# Altium project HMI Adapter.PrjPcb
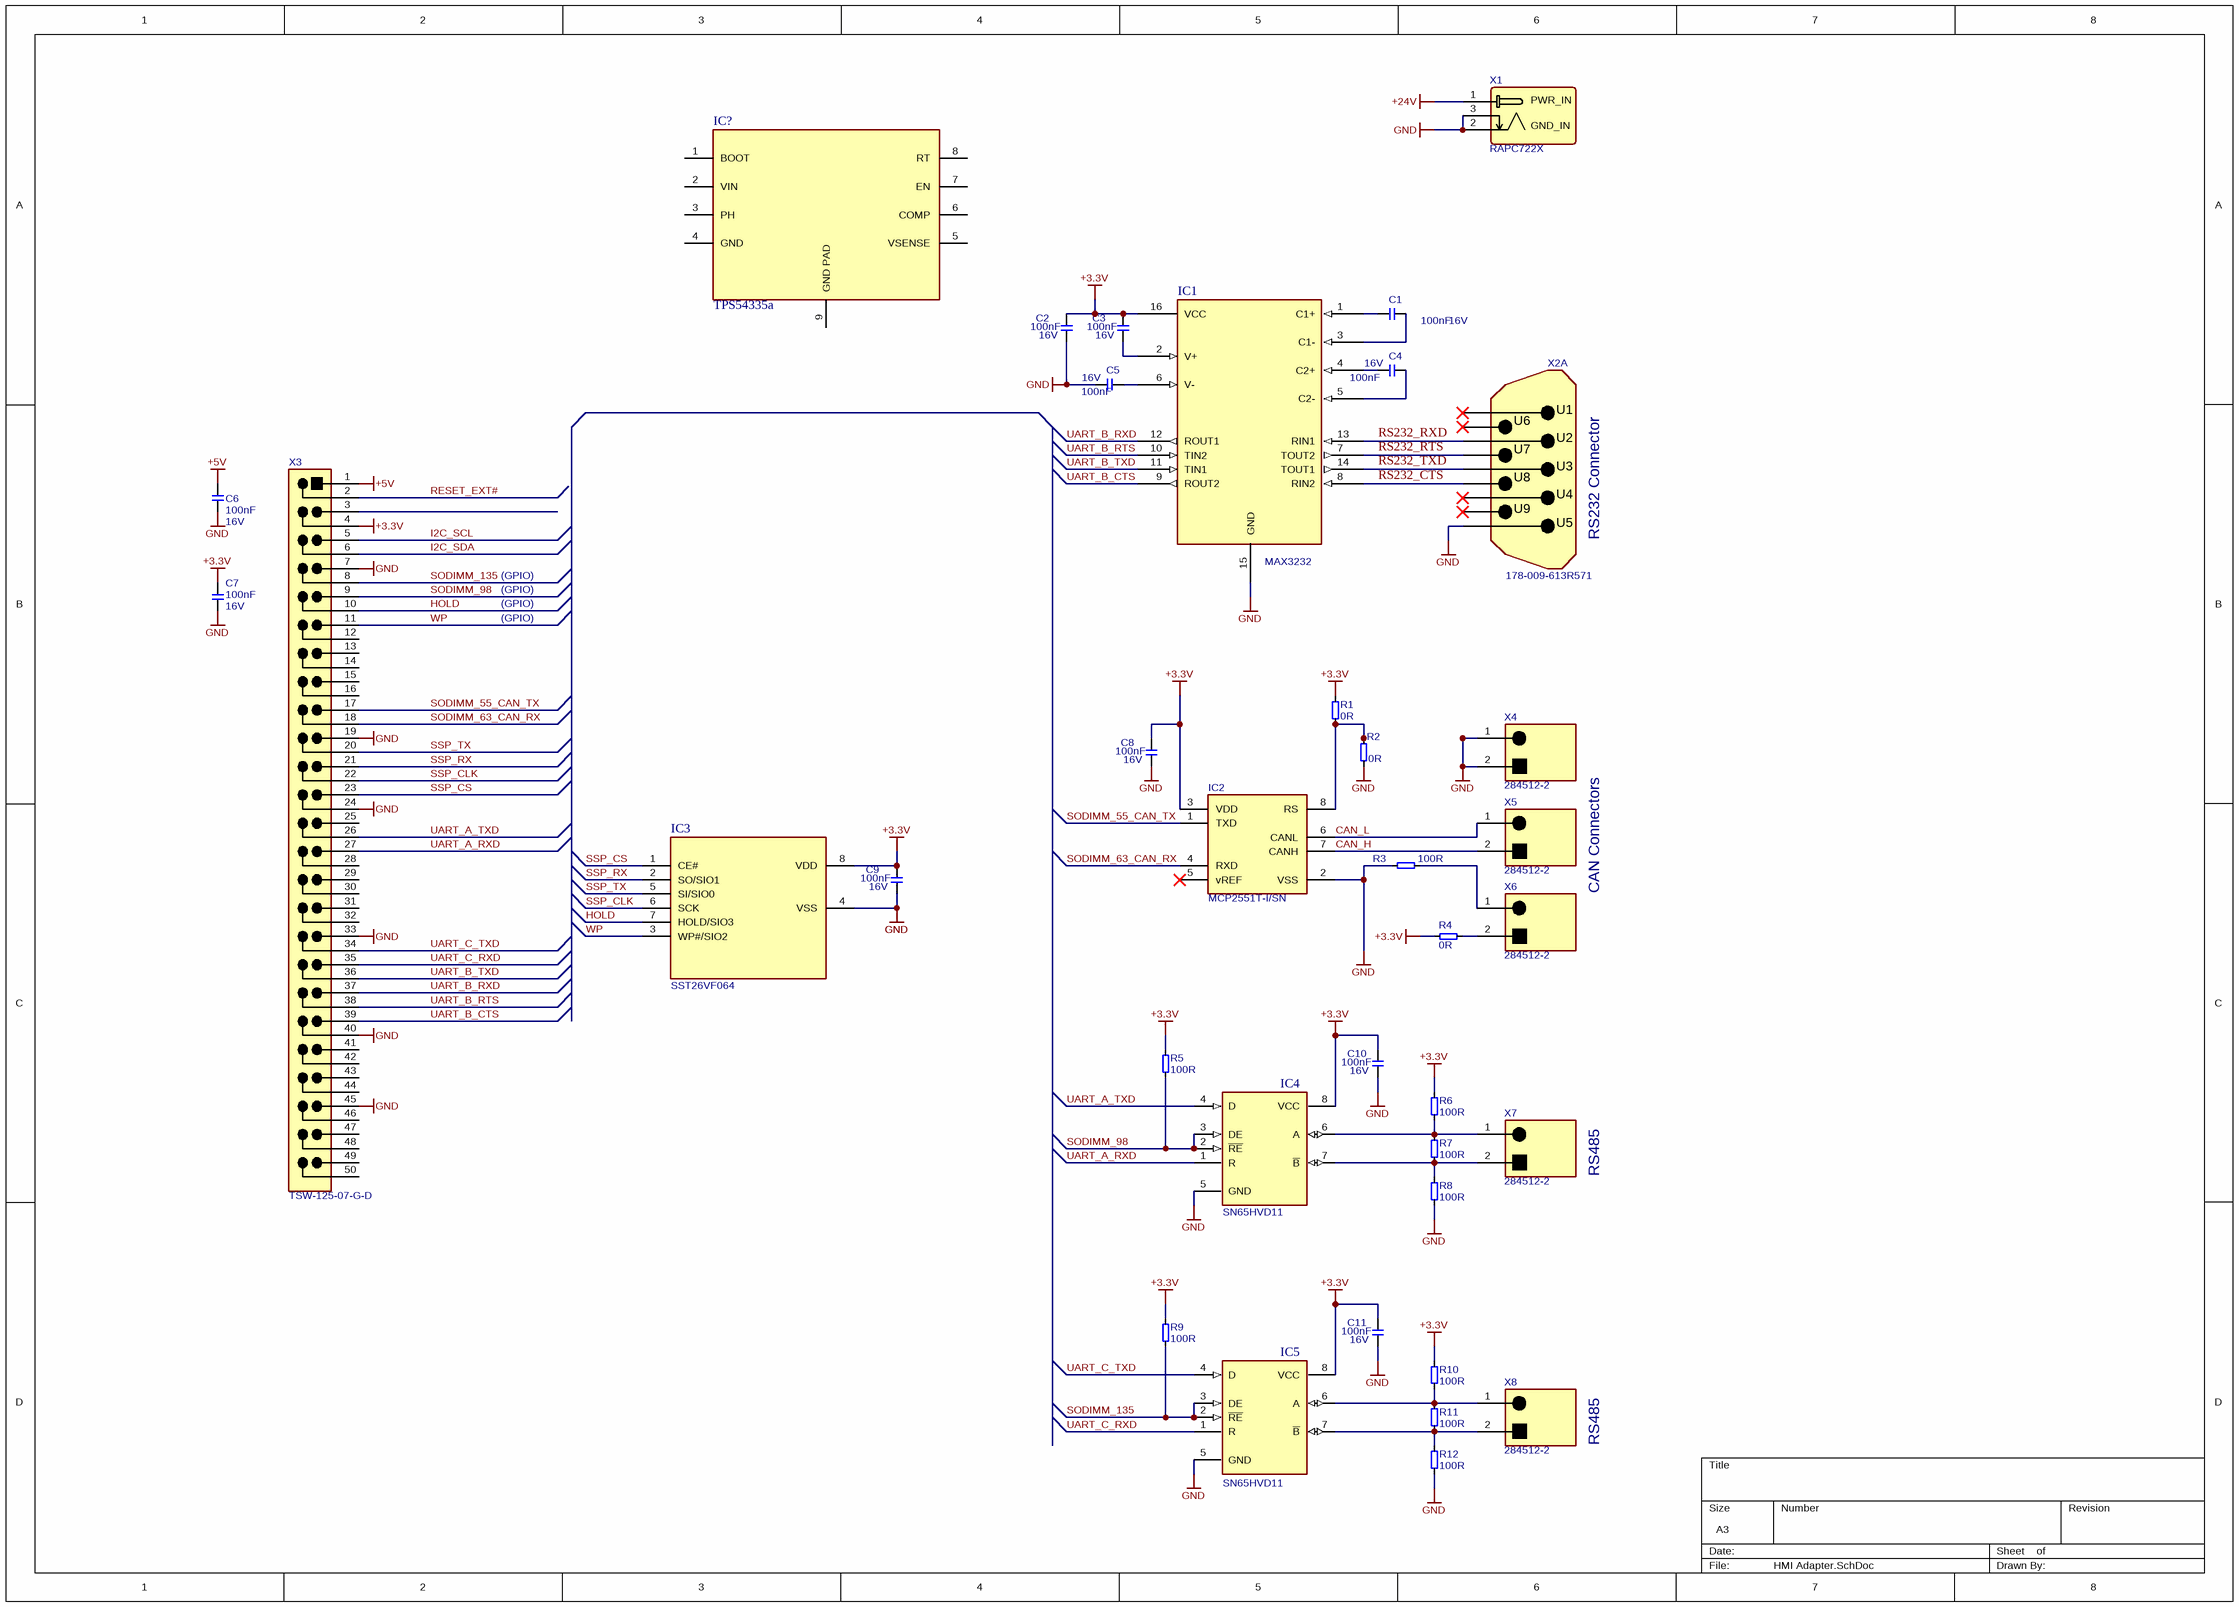
[diagram p0: HMI Adapter.SchDoc]
1 sheet, 37 parts. Net scope: global (net labels, ports and power ports of the same name join across sheets).

## Sheet HMI Adapter.SchDoc
size A3; DrawnBy: Pallav Aggarwal; Revision: 1.0; SheetNumber: 1; SheetTotal: 1

### Parts
C1  Rating: 16V  [T_CAPC0603X33N]  (hidden comment: 100nF)
C2  Rating: 16V  [T_CAPC0603X33N]  (hidden comment: 100nF)
C3  Rating: 16V  [T_CAPC0603X33N]  (hidden comment: 100nF)
C4  Rating: 16V  [T_CAPC0603X33N]  (hidden comment: 100nF)
C5  Rating: 16V  [T_CAPC0603X33N]  (hidden comment: 100nF)
C6  Rating: 16V  [T_CAPC0603X33N]  (hidden comment: 100nF)
C7  Rating: 16V  [T_CAPC0603X33N]  (hidden comment: 100nF)
C8  Rating: 16V  [T_CAPC0603X33N]  (hidden comment: 100nF)
C9  Rating: 16V  [T_CAPC0603X33N]  (hidden comment: 100nF)
C10  Rating: 16V  [T_CAPC0603X33N]  (hidden comment: 100nF)
C11  Rating: 16V  [T_CAPC0603X33N]  (hidden comment: 100nF)
IC1  MAX3232  [DIP16]
IC2  MCP2551T-I/SN  [SOIC127P600X173-8N]
IC3  SST26VF064
IC4  SN65HVD11  [DIP8]
IC5  SN65HVD11  [DIP8]
IC?  TPS54335a
R1  0R  [T_RESC0603X30N]
R2  0R  [T_RESC0603X30N]
R3  100R  [T_RESC0603X30N]
R4  0R  [T_RESC0603X30N]
R5  100R  [T_RESC0603X30N]
R6  100R  [T_RESC0603X30N]
R7  100R  [T_RESC0603X30N]
R8  100R  [T_RESC0603X30N]
R9  100R  [T_RESC0603X30N]
R10  100R  [T_RESC0603X30N]
R11  100R  [T_RESC0603X30N]
R12  100R  [T_RESC0603X30N]
X1  RAPC722X  [T_RAPC722X]
X2  178-009-613R571  [T_NorComp_178-YYY-613R691]  (part A of 3)
X3  TSW-125-07-G-D  [T_HeaderPin_Male_50Pin_2.54mmPitch]
X4  284512-2  [T_TYCO_284512-2]
X5  284512-2  [T_TYCO_284512-2]
X6  284512-2  [T_TYCO_284512-2]
X7  284512-2  [T_TYCO_284512-2]
X8  284512-2  [T_TYCO_284512-2]

### Nets
+3.3V: C2.2 C3.2 C7.2 C8.2 C9.2 C10.2 C11.2 IC1.16(VCC) IC2.3(VDD) IC3.8(VDD) IC4.8(VCC) IC5.8(VCC) R1.2 R4.2 R5.1 R6.1 R9.1 R10.1 X3.4
+5V: C6.2 X3.1
+24V: X1.1(GND_IN)
GND: C2.1 C6.1 C7.1 C8.1 C9.1 C10.1 C11.1 IC1.15(GND) IC2.2(VSS) IC3.4(VSS) IC4.5(GND) IC5.5(GND) R2.1 R3.2 R8.2 R12.2 X1.2(PWR_IN) X1.3(PWR_IN) X2.U5(GND) X3.7 X3.19 X3.24 X3.33 X3.40 X3.45 X4.1 X4.2
CAN_H: IC2.7(CANH) X5.2
CAN_L: IC2.6(CANL) X5.1
HOLD: IC3.7(HOLD/SIO3) X3.10
I2C_SCL: X3.5
I2C_SDA: X3.6
RESET_EXT#: X3.2
RS232_CTS: IC1.8(RIN2) X2.U8(CTS)
RS232_RTS: IC1.7(TOUT2) X2.U7(RTS)
RS232_RXD: IC1.13(RIN1) X2.U2(RXD)
RS232_TXD: IC1.14(TOUT1) X2.U3(TXD)
SODIMM_55_CAN_TX: IC2.1(TXD) X3.17
SODIMM_63_CAN_RX: IC2.4(RXD) X3.18
SODIMM_98: IC4.2(~{RE}) IC4.3(DE) R5.2 X3.9
SODIMM_135: IC5.2(~{RE}) IC5.3(DE) R9.2 X3.8
SSP_CLK: IC3.6(SCK) X3.22
SSP_CS: IC3.1(CE#) X3.23
SSP_RX: IC3.2(SO/SIO1) X3.21
SSP_TX: IC3.5(SI/SIO0) X3.20
UART_A_RXD: IC4.1(R) X3.27
UART_A_TXD: IC4.4(D) X3.26
UART_B_CTS: IC1.9(ROUT2) X3.39
UART_B_RTS: IC1.10(TIN2) X3.38
UART_B_RXD: IC1.12(ROUT1) X3.37
UART_B_TXD: IC1.11(TIN1) X3.36
UART_C_RXD: IC5.1(R) X3.35
UART_C_TXD: IC5.4(D) X3.34
WP: IC3.3(WP#/SIO2) X3.11
NetC1_1: C1.1 IC1.3(C1-)
NetC1_2: C1.2 IC1.1(C1+)
NetC3_1: C3.1 IC1.2(V+)
NetC4_1: C4.1 IC1.5(C2-)
NetC4_2: C4.2 IC1.4(C2+)
NetC5_1: C5.1 IC1.6(V-)
NetIC2_8: IC2.8(RS) R1.1 R2.2
NetIC4_6: IC4.6(A) R6.2 R7.1 X7.1
NetIC4_7: IC4.7(~{B}) R7.2 R8.1 X7.2
NetIC5_6: IC5.6(A) R10.2 R11.1 X8.1
NetIC5_7: IC5.7(~{B}) R11.2 R12.1 X8.2
NetR3_1: R3.1 X6.1
NetR4_1: R4.1 X6.2

Not connected (* = marked no-connect by the designer): C5 2; IC2 5(vREF)*; IC? 1(BOOT) 2(VIN) 3(PH) 4(GND) 5(VSENSE) 6(COMP) 7(EN) 8(RT) 9(GND_PAD); X2 U1(DCD)* U4(DTR)* U6(DSR)* U9(RI)*; X3 3 12 13 14 15 16 25 28 29 30 31 32 41 42 43 44 46 47 48 49 50

### Notes on the sheet
- RS232 Connector
- (GPIO)
- CAN Connectors
- RS485

### Library data of the parts
C1-C11 = C-X7R-100nF-16V-10%-0603: Capacitor Ceramic X7R 100nF 16V 10% 0603; Tolerance: 10%; Type: X7R; Value: 100nF
IC1 = MAX232
IC2 = IC-MC-MCP2551T-I/SN: High speed CAN Transceiver; Manufacturer Name: Microchip; Manufacturer Part No.: MCP2551T-I/SN
IC4 IC5 = SN75ALS176AD: Differential Bus Transceiver
R1 R2 R4 = R-0R-63mW-1%-0603: Resistor 0 ohm 63mW 1% 0603; Rating: 63mW; Tolerance: 1%; Value: 0R
R3 R5-R12 = R-100R-63mW-5%-0603: Resistor 100 ohm 63mW 5% 0603; Rating: 63mW; Tolerance: 5%; Value: 100R
X1 = CON-SwitchCraft-RAPC722X: Power Jack; Manufacturer Part No.: RAPC722X
X2 = CON-NorComp-178-009-613R571: RS232 Connector 9 pins male; No. of Ways: 18; Manufacturer Name: NorComp; Manufacturer Part No.: 178-009-613R571
X3 = CON-Samtec-TSW-125-07-G-D-Male: Header, 2x25 Pins, 2.54 mm pitch; Manufacturer Name: Samtec; Pitch: 2.54mm; No. of ways: 2x25; Manufacturer Part No.: TSW-125-07-G-D
X4-X8 = CON-Tyco-284512-2-1x2-3.5mm: Power Connector; Manufacturer Name: Tyco; No. of ways: 1x2; Pitch: 3.5mm; Manufacturer Part No.: 284512-2